# Altium schematic sheet Coax_POC.SchDoc
size B; SheetNumber: 1; SheetTotal: 1
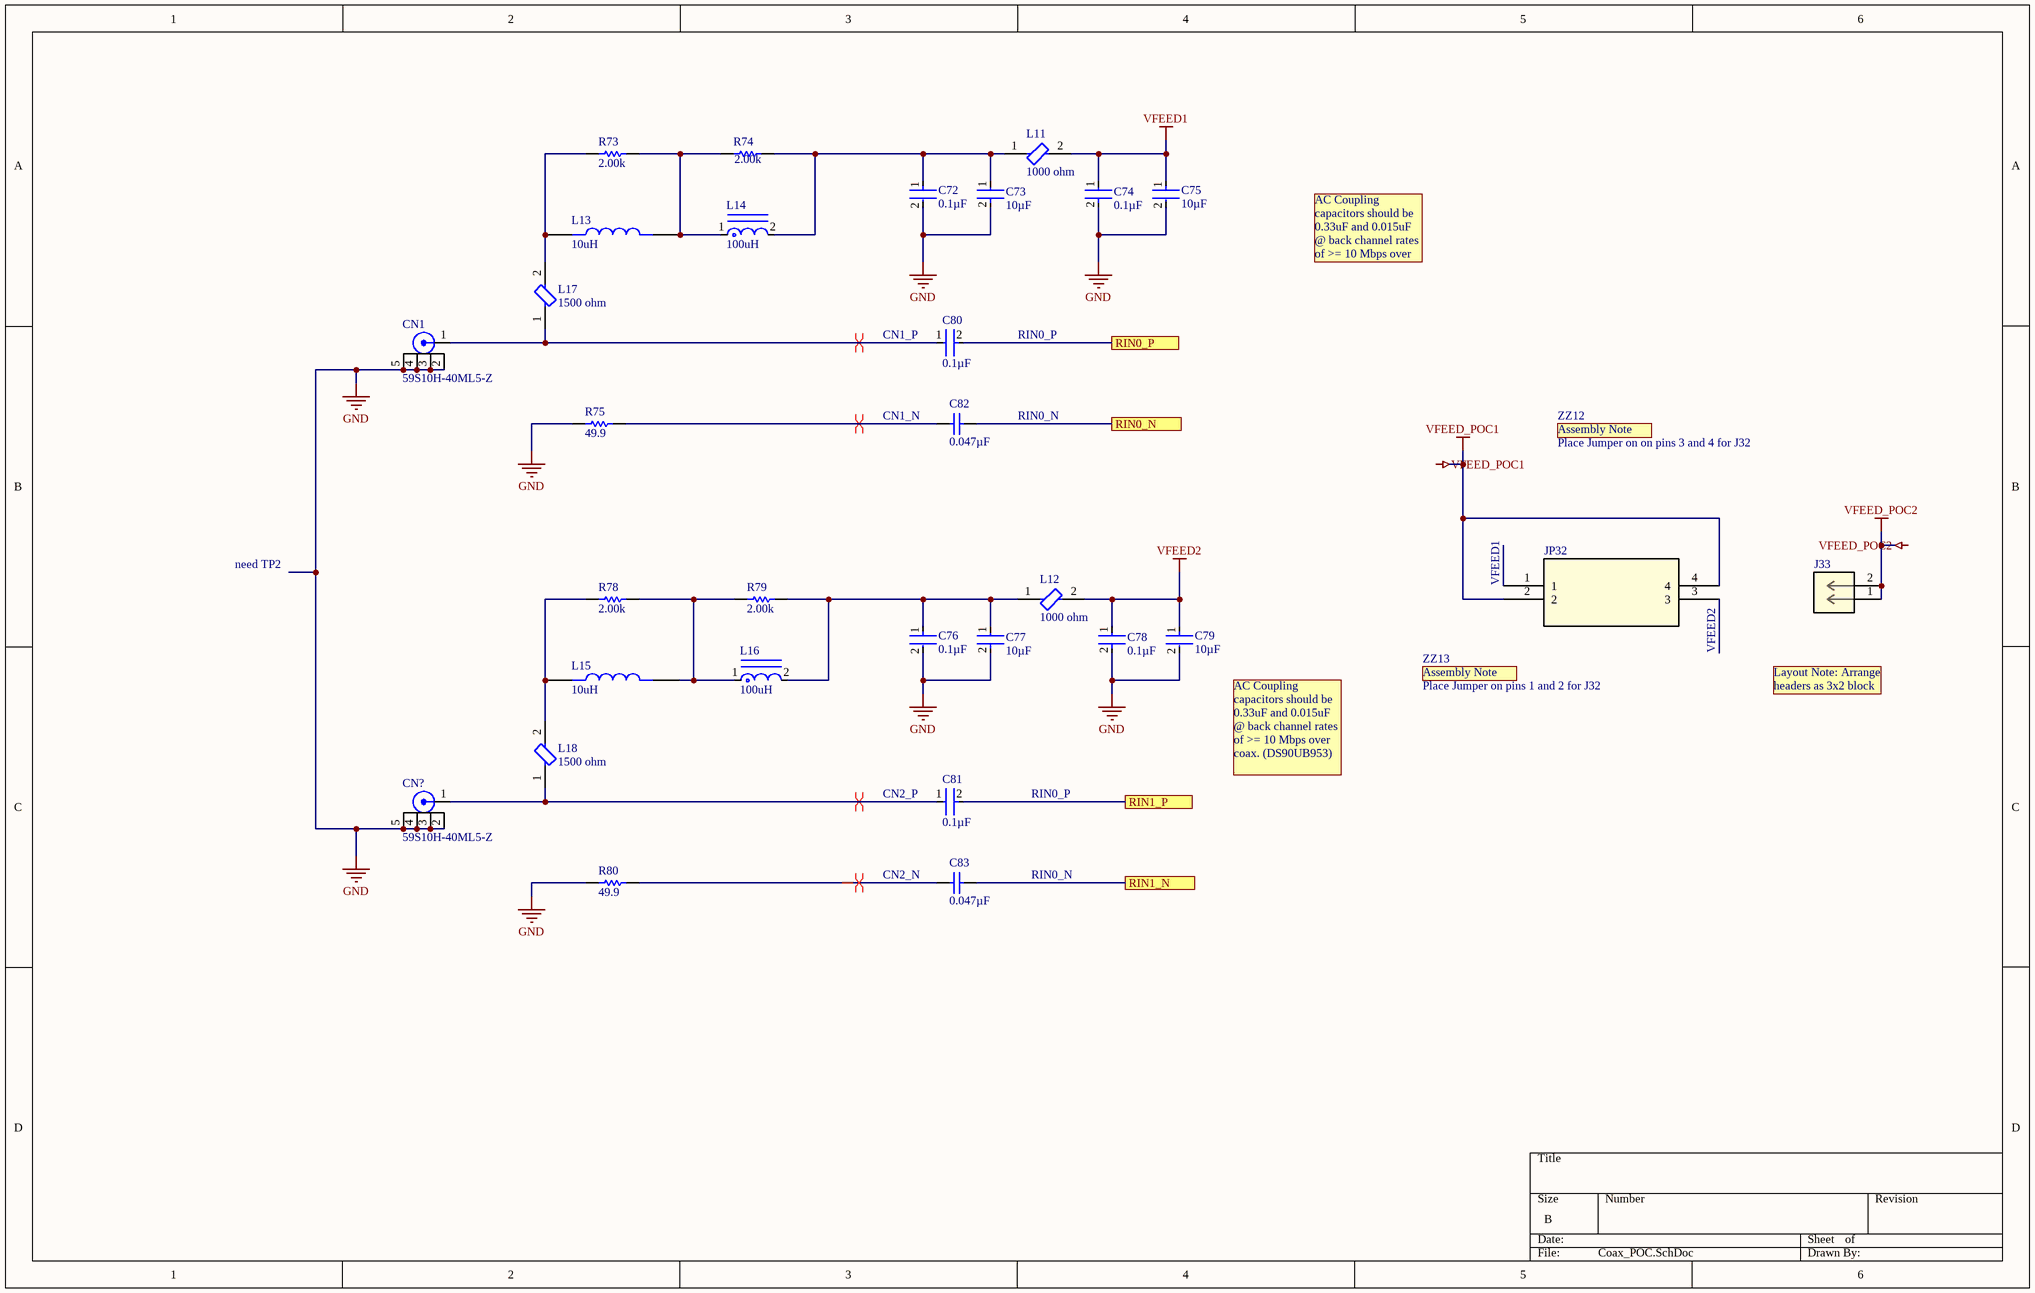
[diagram p0: Coax_POC.SchDoc]

## Parts
C72  0.1µF  [FP-C0402-BB-MFG]
C73  10µF  [FP-GRM15-MFG]
C74  0.1µF  [FP-GRM15-MFG]
C75  10µF  [FP-C0402-BB-MFG]
C76  0.1µF  [FP-C0402-BB-MFG]
C77  10µF  [FP-C1608-080-0_1-IPC_B]
C78  0.1µF  [FP-GRM15-MFG]
C79  10µF  [FP-C0402-BB-MFG]
C80  0.1µF  [FP-GRM15-MFG]
C81  0.1µF  [FP-GRM15-MFG]
C82  0.047µF  [CAPC2013X140X45NL15T25]
C83  0.047µF  [CAPC2013X140X45NL15T25]
CN1  59S10H-40ML5-Z  [ROSENBERGER_59S2AQ-40MT5-Z_1]
CN?  59S10H-40ML5-Z  [ROSENBERGER_59S2AQ-40MT5-Z_1]
J33  (no value)  [CON2_1X2_TU_TSW]
JP32  (no value)  [TSW-102-07-G-D_SAI]
L11  1000 ohm  [FP-BLM18-0_15-t0_8-MFG]
L12  1000 ohm  [FP-BLM18-0_15-t0_8-MFG]
L13  10uH  [IND_ADL3225V-470MT-TL000]
L14  100uH  [FP-MPI4020V2-MFG]
L15  10uH  [IND_ADL3225V-470MT-TL000]
L16  100uH  [FP-MPI4020V2-MFG]
L17  1500 ohm  [FP-BLM18-0_15-t0_8-MFG]
L18  1500 ohm  [FP-BLM18-0_15-t0_8-MFG]
R73  2.00k  [RESC1005X40X25LL05T05]
R74  2.00k  [RESC1608X55X30ML15T15]
R75  49.9  [RESC1005X40X25LL05T05]
R78  2.00k  [RESC1005X40X25LL05T05]
R79  2.00k  [RESC1005X40X25LL05T05]
R80  49.9  [RESC1608X55X30ML15T15]

## Ports
RIN0_N, RIN0_P, RIN1_N, RIN1_P

## Nets
GND: C72.2 C73.2 C74.2 C75.2 C76.2 C77.2 C78.2 C79.2 CN1.2 CN1.3 CN1.4 CN1.5 CN?.2 CN?.3 CN?.4 CN?.5 R75.1 R80.1
VFEED1: C74.1 C75.1 L11.2
VFEED2: C78.1 C79.1 L12.2
VFEED_POC1: JP32.2 JP32.4
VFEED_POC2: J33.1 J33.2
RIN0_N: C82.2 ; port RIN0_N
RIN0_P: C80.2 ; port RIN0_P
RIN1_N: C83.2 ; port RIN1_N
RIN1_P: C81.2 ; port RIN1_P
NetC72_1: C72.1 C73.1 L11.1 L14.2 R74.2
NetC76_1: C76.1 C77.1 L12.1 L16.2 R79.2
NetC80_1: C80.1 CN1.1 L17.1
NetC81_1: C81.1 CN?.1 L18.1
NetC82_1: C82.1 R75.2
NetC83_1: C83.1 R80.2
NetL13_1: L13.1 L17.2 R73.1
NetL13_2: L13.2 L14.1 R73.2 R74.1
NetL15_1: L15.1 L18.2 R78.1
NetL15_2: L15.2 L16.1 R78.2 R79.1

Not connected (* = marked no-connect by the designer): JP32 1 3

## Layout directives
differential pair: NetC80_1, NetC81_1, NetC82_1, NetC83_1

## Notes on the sheet
- AC Coupling
- capacitors should be
- 0.33uF and 0.015uF
- @ back channel rates
- of >= 10 Mbps over
- (near C80) CN1_P
- RIN0_P
- (near C82) CN1_N
- RIN0_N
- ZZ12
- Assembly Note
- Place Jumper on on pins 3 and 4 for J32
- need TP2
- (near JP32) VFEED1
- ZZ13
- Place Jumper on pins 1 and 2 for J32
- (near JP32) VFEED2
- Layout Note: Arrange
- headers as 3x2 block
- coax. (DS90UB953)
- (near C81) CN2_P
- (near C83) CN2_N
- Labels drawn without touching a wire or pin: VFEED_POC1, VFEED_POC2

## Library data of the parts
C72 = CMP-1034-02057-3: Multilayer Ceramic Capacitor, C Series, 0.082 - F, - 10%, X7r, 16 V, 0402 [1005 Metric] Rohs Compliant: Yes; Manufacturer: Kemet; Manufacturer Part Number: C0402C823K4RACTU; Capacitance: 82,000 pF; Voltage Rating: 16 V; Description: C0402 82,000 pF X7R 10.00% 16 V; Temperature Coefficient: 15%; Value: 82,000 pF; Tolerance: 0.1; Device Class L2: Capacitors; ComponentLink2Description: Datasheet; Category: Cap; Temperature Range High: +125°C; Height: 0.55mm; Lead Free: Yes; Octopart: https://octopart.com/c0402c823k4ractu-kemet-134782; Device Class L3: Ceramic Capacitors; Ipc Land Pattern Name: CAPC10050X50; Package: C0402-BB; Temperature Range Low: -55°C; Temperature: -55°C to +125°C; Mouser Description: Multilayer Ceramic Capacitors MLCC - SMD/SMT 16volts 82000pF X7R 10%; Material: Ceramic; ComponentLink2URL: https://content.kemet.com/datasheets/KEM_C1002_X7R_SMD.pdf; Device Class L1: Passive Components; RoHS: TRUE; Automotive: No; Temperature Characteristic: X7R; Digikey Description: Multilayer Ceramic Capacitor, C Series, 0.082 - F, - 10%, X7r, 16 V, 0402 [1005 Metric] Rohs Compliant: Yes
C73 C74 C78 C80 C81 = CMP-2100-03641-2: CAP CER 0.1UF 16V X7R 0402; Manufacturer Part Number: GRM155R71C104KA88D; Manufacturer: Murata; Standoff Height: 0mm; Tolerance: 10%; Description: CAP Ceramic 0.10μF 10% X7R 16Vdc 0402 SMD; Voltage Rating: 16Vdc; Material: Ceramic; Capacitance: 0.10μF; Value: 0.10μF; RoHS: TRUE; Temperature Characteristic: X7R; Octopart: https://octopart.com/grm155r71c104ka88d-murata-196880; Digikey Description: CAP CER 0.1UF 16V X7R 0402; Device Class L3: Ceramic Capacitors; Height: 0.55mm; ComponentLink2Description: Datasheet; Temperature Range Low: -55°C; Ipc Land Pattern Name: CAPC10050X219; ComponentLink2URL: https://search.murata.co.jp/Ceramy/image/img/A01X/G101/ENG/GRM155R71H471KA01-01A.pdf; Device Class L1: Passive Components; Lead Free: yes; Category: Cap; Package: GRM15; Temperature: -55°C to +125°C; Device Class L2: Capacitors; Temperature Range High: +125°C; Mouser Description: 0402 0.1 uF 16V ±10 % Tolerance X7R SMT Multilayer Ceramic Capacitor
C75 C79 = CMP-1034-01791-3: CAP CER 3900PF 16V X7R 0402; Manufacturer Part Number: C0402C392K4RACTU; Manufacturer: Kemet; Value: 3,900 pF; Temperature Coefficient: 15%; Tolerance: 0.1; Material: Ceramic; Description: C0402 3,900 pF X7R 10.00% 16 V; Temperature Range High: +125°C; Automotive: No; Octopart: https://octopart.com/c0402c392k4ractu-kemet-12577363; RoHS: TRUE; Category: Cap; Temperature Range Low: -55°C; Device Class L1: Passive Components; Digikey Description: CAP CER 3900PF 16V X7R 0402; ComponentLink2Description: Datasheet; Voltage Rating: 16 V; Device Class L2: Capacitors; ComponentLink2URL: https://content.kemet.com/datasheets/KEM_C1002_X7R_SMD.pdf; Package: C0402-BB; Lead Free: Yes; Ipc Land Pattern Name: CAPC10050X50; Mouser Description: Multilayer Ceramic Capacitors MLCC - SMD/SMT 16volts 3900pF X7R 10%; Temperature Characteristic: X7R; Height: 0.55mm; Temperature: -55°C to +125°C; Device Class L3: Ceramic Capacitors; Capacitance: 3,900 pF
C76 = CMP-2008-03330-2: CAP CER 12PF 25V C0G/NP0 0402; Manufacturer Part Number: C0402C120J3GACAUTO; Manufacturer: Kemet; Material: Ceramic; Temperature Characteristic: C0G; Temperature Coefficient: 15%; Tolerance: 0.05; Description: C0402 12 pF C0G 5.00% 25 V; Temperature Range High: +125°C; ComponentLink2URL: https://content.kemet.com/datasheets/KEM_C1002_X7R_SMD.pdf; Lead Free: Yes; Device Class L2: Capacitors; Voltage Rating: 25 V; Device Class L1: Passive Components; Temperature Range Low: -55°C; Value: 12 pF; Automotive: No; Category: Cap; Height: 0.55mm; Octopart: https://octopart.com/c0402c120j3gacauto-kemet-21768529; Digikey Description: CAP CER 12PF 25V C0G/NP0 0402; Temperature: -55°C to +125°C; Device Class L3: Ceramic Capacitors; Package: C0402-BB; Capacitance: 12 pF; ComponentLink2Description: Datasheet; Ipc Land Pattern Name: CAPC10050X50; RoHS: TRUE
C77 = CMP-2000-04982-2: Multilayer Ceramic Capacitors 100nF ±10% 50V X7R SMD 0603; REACH SVHC: No SVHC; Voltage: 50V; Min Operating Temperature: -55°C; Package Quantity: 1; Case Code (Metric): 1608; Series: C; Termination: SMD/SMT; Length: 1.6mm; Voltage Rating: 50V; Case Code (Imperial): 0603; Number of Pins: 2; RoHS Compliant: Yes; Thickness: 0.037inch; Resistor Type: Ceramic; Radiation Hardening: No; Weight: 7.1E-05oz; Mount: Surface Mount; Capacitance: 100nF; Voltage Rating (DC): 50V; Construction: Flat; Tolerance: 10%; Lead Free: Lead Free; Case/Package: 0603; Max Operating Temperature: 125°C; Height: 0.8mm; Depth: 0.8mm; Packaging: Tape and Reel; Width: 0.031inch; Dielectric Material: Ceramic; Dielectric: X7R
C82 C83 = CMP-2007-03395-1: Part Number: GRM21BR71A106KE51L; Manufacturer: Murata
CN1 CN? = 59S2AQ-40MT5-Z_1: RF Connectors / Coaxial Connectors Plug PC-Board SMD Right AngleZWatrBlue; Package: None; Price: None; Value: *; MP: 59S2AQ-40MT5-Z_1; Availability: Unavailable
J33 = TSW-102-07-G-S: Description; Manufacturer_Name: Samtec Inc; Copyright: Copyright (C) 2025 Ultra Librarian. All rights reserved.; Manufacturer_Part_Number: TSW-102-07-G-S; RefDes: RefDes; Type: Type
JP32 = TSW-102-07-G-D: Description; Manufacturer_Name: Samtec Inc; Copyright: Copyright (C) 2025 Ultra Librarian. All rights reserved.; Manufacturer_Part_Number: TSW-102-07-G-D; RefDes: RefDes; Type: Type
L11 L12 L17 L18 = CMP-0686-00457-3: Chip Ferrite Bead, 0603, 1000Ω @ 100MHz, 0.5Ω, 25%, 450mA; Number of Circuits: 1; Max DC Current: 400mA; Shielding: Unshielded; DC Resistance (DCR): 500mR; Material: Steel; DC Resistance-Max: 700mR; Impedance: 1kR; Case Code (Imperial): 0603; Max Current Rating: 400mA; Frequency: 100MHz; Min Operating Temperature: -55°C; Case/Package: 0603; Depth: 0.8mm; Lead Free: Lead Free; Core Material: Ferrite; Current Rating: 400mA; Resistance: 500mR; Case Code (Metric): 1608; DC Current: 400mA; Package Quantity: 1; Packaging: Tape and Reel; Width: 0.8mm; Military Standard: Not; Height: 0.8mm; Series: BLM18A; Max Operating Temperature: 125°C; Tolerance: 25%; Termination: SMD/SMT; Test Frequency: 100MHz; Number of Lines: 1; Number of Pins: 2; REACH SVHC: No SVHC; Length: 1.6mm; Radiation Hardening: No
L13 L15 = ADL3225V-470MT-TL000: MF: {'manufacturer': u'TDK'}; Value: *; Availability: Unavailable; MP: ADL3225V-470MT-TL000; Price: None; Package: None
L14 L16 = CMP-00112-75645210-1: MPI4020V2-4R7-R Inductor Power Shielded Wirewound 4.7uH 20% 100KHz 2.7A 118mOhm DCR; Current Rating: 2.8A; Self Resonant Frequency: 24MHz; Resistance: 118mΩ; DC Resistance (DCR): 105mΩ; Saturation Current: 3A; Inductance: 4.7µH; Min Operating Temperature: -55°C; Length: 3.9878mm; Tolerance: 20%; Max Operating Temperature: 125°C; Composition: Wirewound; RoHS: Compliant; Shielding: Shielded; Width: 3.9878mm; Series Resistance: 118mΩ; Height: 2mm; Test Frequency: 100kHz; Height - Seated (Max): 2.032mm; Mount: Surface Mount; RMS Current (Irms): 2.7A; NexarPartId: 75645210
R73 R75 R78 R79 = CMP-2000-07451-1: Chip Resistor, 0 Ohm, 0.1 W, -55 to 155 degC, 0402 (1005 Metric), RoHS, Tape and Reel; Manufacturer: Panasonic; Voltage Rating (DC): 50V; Temperature Coefficient: 600ppm/��C; Max Power Dissipation: 100mW; Resistance: 0mOhm; Tolerance: 5%; Number of Terminations: 2; Mount: SurfaceMount; Height: 0.35mm; Packaging: TapeandReel; Contact Plating: Tin; Manufacturer URL: http://www.panasonic.com/; Composition: ThickFilm; Max Operating Temperature: 155degC; REACH SVHC: NoSVHC; Case/Package: 0402; Package Reference: 402; Depth: 0.5mm; Package Description: 2-Pin Surface Mount Device, Body 1 x 0.5 mm; Datasheet URL: https://industrial.panasonic.com/cdbs/www-data/pdf/RDA0000/AOA0000C301.pdf; RoHSCompliant: True; Case Code (Imperial): 0402; Military Standard: Not; Min Operating Temperature: -55degC; Power Rating: 100mW; Datasheet Version: 03/2015; Length: 1mm; Case Code (Metric): 1005; Termination: SMD/SMT; Mounting Technology: SurfaceMount; Voltage Rating: 50V; Width: 0.02inch; Package Quantity: 1; Lead Free: LeadFree; Radiation Hardening: No
R74 R80 = CMP-2000-00538-1: Manufacturer: Panasonic; Part Number: ERJ-3EKF49R9V